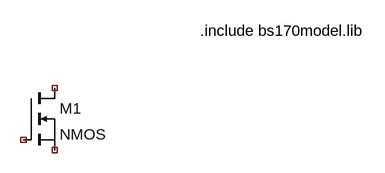
[diagram p0: schematic lab 2.asc]
lab 2.asc, the LTspice schematic file:
Version 4
SHEET 1 880 680
SYMBOL nmos 160 96 R0
SYMATTR InstName M1
TEXT 432 8 Left 2 !.include bs170model.lib

The netlist it stands for:
* lab 2.asc
M1 NC_01 NC_02 NC_03 NC_03 NMOS
.model NMOS NMOS
.model PMOS PMOS
.lib standard.mos
.include bs170model.lib
.backanno
.end